# Altium schematic sheet Radio.SCHDOC
size A4
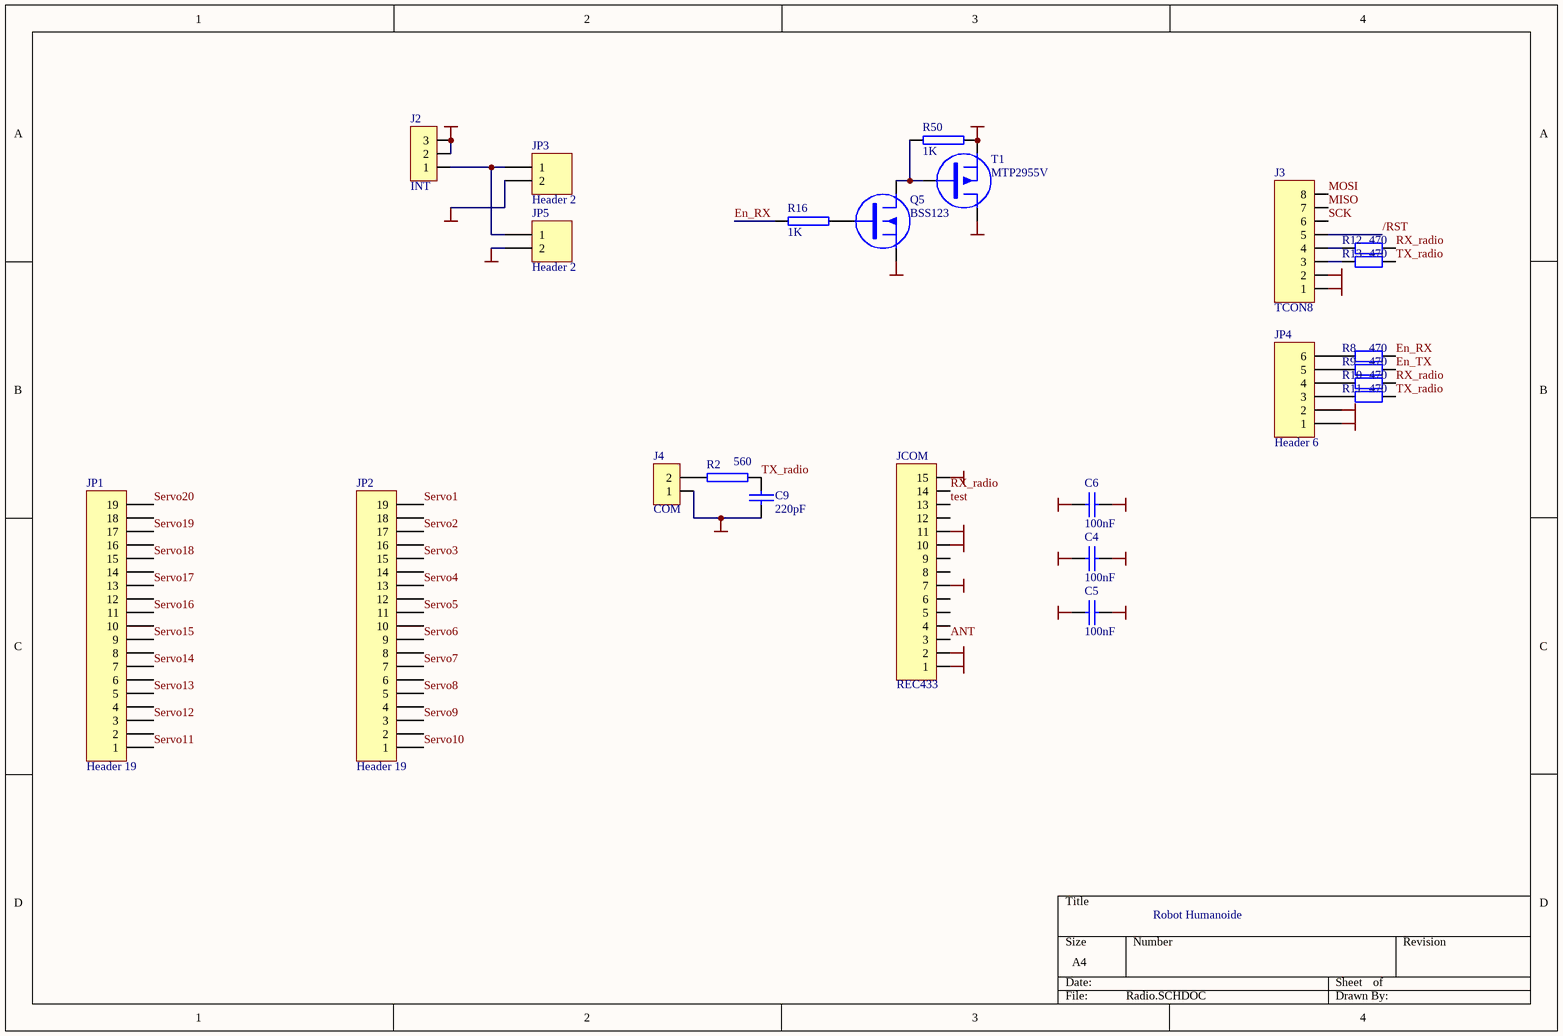
[diagram p0: Radio.SCHDOC]

## Parts
C4  100nF  [0805]
C5  100nF  [0805]
C6  100nF  [0805]
C9  220pF  [0805]
J2  INT  [TSIP3]
J3  TCON8  [TSIP8]
J4  COM  [CON2]
JCOM  REC433  [TSIP15]
JP1  Header 19  [HDR1X19]
JP2  Header 19  [HDR1X19]
JP3  Header 2  [HDR1X2]
JP4  Header 6  [TSIP6]
JP5  Header 2  [HDR1X2]
Q5  BSS123  [SOT-23]
R2  560  [0805]
R8  value 470  [0805]  (hidden comment: Res2)
R9  value 470  [0805]  (hidden comment: Res2)
R10  value 470  [0805]  (hidden comment: Res2)
R11  value 470  [0805]  (hidden comment: Res2)
R12  value 470  [0805]  (hidden comment: Res2)
R13  value 470  [0805]  (hidden comment: Res2)
R16  1K  [0805]
R50  1K  [0805]
T1  MTP2955V  [TTO220C]

## Nets
5V: C4.2 C5.2 C6.2 J3.1 JCOM.1 JCOM.10 JCOM.15 JP4.1 T1.2(C)
GND: C4.1 C5.1 C6.1 C9.1 J3.2 J4.1 JCOM.2 JCOM.7 JCOM.11 JP3.2 JP4.2 JP5.2 Q5.2(C)
VCC: J2.2 J2.3 R50.2 T1.3(E)
/RST: J3.5
ANT: JCOM.3
En_RX: R8.2 R16.1
En_TX: R9.2
MISO: J3.7
MOSI: J3.8
RX_radio: JCOM.14 R10.2 R12.2
SCK: J3.6
Servo1: JP2.19
Servo2: JP2.17
Servo3: JP2.15
Servo4: JP2.13
Servo5: JP2.11
Servo6: JP2.9
Servo7: JP2.7
Servo8: JP2.5
Servo9: JP2.3
Servo10: JP2.1
Servo11: JP1.1
Servo12: JP1.3
Servo13: JP1.5
Servo14: JP1.7
Servo15: JP1.9
Servo16: JP1.11
Servo17: JP1.13
Servo18: JP1.15
Servo19: JP1.17
Servo20: JP1.19
test: JCOM.13
TX_radio: C9.2 R2.2 R11.2 R13.2
NetJ2_1: J2.1 JP3.1 JP5.1
NetJ3_3: J3.3 R13.1
NetJ3_4: J3.4 R12.1
NetJ4_2: J4.2 R2.1
NetJP4_3: JP4.3 R11.1
NetJP4_4: JP4.4 R10.1
NetJP4_5: JP4.5 R9.1
NetJP4_6: JP4.6 R8.1
NetQ5_1: Q5.1(B) R16.2
NetQ5_3: Q5.3(E) R50.1 T1.1(B)

Not connected (* = marked no-connect by the designer): JCOM 4 5 6 8 9 12; JP1 2 4 6 8 10 12 14 16 18; JP2 2 4 6 8 10 12 14 16 18

## Notes on the sheet
- Robot Humanoide

## Library data of the parts
C4-C6 C9 = CAP: Manufacturer: Generic Components; Class: Passive; SubClass: Capacitor; Published: 08/06/2000; Publisher: Altium Hobart Technology Centre; Value: *
J2 = TCON3
J4 = CON2
JCOM = CON15
JP1 JP2 = Header 19: Header, 19-Pin; Revision: 17-Jul-2002: Re-released for DXP Platform.; Publisher: Altium Limited
JP3 JP5 = Header 2: Header, 2-Pin; Revision: 17-Jul-2002: Re-released for DXP Platform.; Publisher: Altium Limited
JP4 = Header 6: Header, 6-Pin; Revision: 17-Jul-2002: Re-released for DXP Platform.; Publisher: Altium Limited
R2 = RES2: Published: *; Publisher: *; Manufacturer: *; Class: *; SubClass: *
R8-R13 = Res2: Resistor; Published: 8-Jun-2000; Revision: July-2002: Re-released for DXP Platform.; Publisher: Altium Limited
R16 R50 = TRESIST